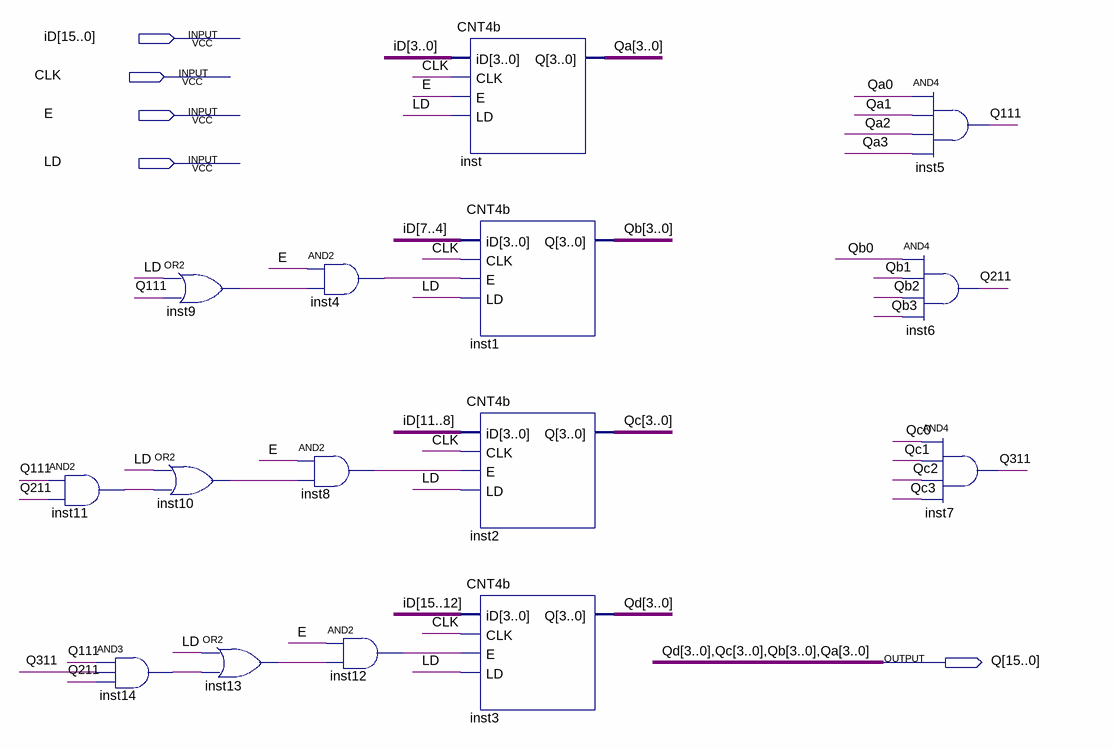
[diagram p0: schematic sheet]
// Quartus schematic CNT16b.bdf as structural Verilog: 15 symbols, 5 pins
module CNT16b (
  input  [15:0] iD,
  input  CLK,
  input  E,
  input  LD,
  output [15:0] Q
);

  wire inst4_out, inst8_out, inst9_out, inst10_out, inst11_out, inst12_out, inst13_out, inst14_out, Q111,
       Q211, Q311;

  and inst11 (inst11_out, Q111, Q211);
  and inst14 (inst14_out, Q111, Q311, Q211);
  or inst9 (inst9_out, LD, Q111);
  or inst10 (inst10_out, LD, inst11_out);
  or inst13 (inst13_out, LD, inst14_out);
  and inst4 (inst4_out, E, inst9_out);
  and inst8 (inst8_out, E, inst10_out);
  and inst12 (inst12_out, E, inst13_out);
  CNT4b inst (.iD(iD[3:0]), .CLK(CLK), .E(E), .LD(LD), .Q(Q[3:0]));
  CNT4b inst1 (.iD(iD[7:4]), .CLK(CLK), .E(inst4_out), .LD(LD), .Q(Q[7:4]));
  CNT4b inst2 (.iD(iD[11:8]), .CLK(CLK), .E(inst8_out), .LD(LD), .Q(Q[11:8]));
  CNT4b inst3 (.iD(iD[15:12]), .CLK(CLK), .E(inst12_out), .LD(LD), .Q(Q[15:12]));
  and inst5 (Q111, Q[0], Q[1], Q[2], Q[3]);
  and inst6 (Q211, Q[4], Q[5], Q[6], Q[7]);
  and inst7 (Q311, Q[8], Q[9], Q[10], Q[11]);

  // Other names for the same wires on the sheet: Qa[3:0] = Q[3:0]; Qa0 = Q[0]; Qa1 = Q[1]; Qa2 = Q[2]; Qa3 = Q[3];
  //   Qb[3:0] = Q[7:4]; Qb0 = Q[4]; Qb1 = Q[5]; Qb2 = Q[6]; Qb3 = Q[7]; Qc[3:0] = Q[11:8]; Qc0 = Q[8]; Qc1 = Q[9];
  //   Qc2 = Q[10]; Qc3 = Q[11]; Qd[3:0] = Q[15:12]
endmodule
